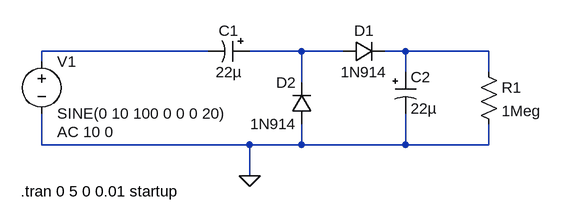
[diagram p0: schematic voltageDoubler.asc]
voltageDoubler.asc, the LTspice schematic file:
Version 4
SHEET 1 880 680
WIRE 224 64 -32 64
WIRE 368 64 288 64
WIRE 432 64 368 64
WIRE 528 64 496 64
WIRE 656 64 528 64
WIRE -32 80 -32 64
WIRE 528 96 528 64
WIRE 656 96 656 64
WIRE 368 112 368 64
WIRE -32 208 -32 160
WIRE 288 208 -32 208
WIRE 368 208 368 176
WIRE 368 208 288 208
WIRE 528 208 528 160
WIRE 528 208 368 208
WIRE 656 208 656 176
WIRE 656 208 528 208
WIRE 288 256 288 208
FLAG 288 256 0
SYMBOL diode 432 80 R270
WINDOW 0 32 32 VTop 2
WINDOW 3 0 32 VBottom 2
SYMATTR InstName D1
SYMATTR Value 1N914
SYMBOL diode 384 176 R180
WINDOW 0 24 64 Left 2
WINDOW 3 24 0 Left 2
SYMATTR InstName D2
SYMATTR Value 1N914
SYMBOL polcap 288 48 R90
WINDOW 0 0 32 VBottom 2
WINDOW 3 32 32 VTop 2
SYMATTR InstName C1
SYMATTR Value 22µ
SYMATTR Description Capacitor
SYMATTR Type cap
SYMATTR SpiceLine V=16 Irms=2.88675 Rser=0.03 Lser=0 mfg="KEMET" pn="A700D226M016ATE030" type="Al electrolytic"
SYMBOL polcap 512 96 R0
SYMATTR InstName C2
SYMATTR Value 22µ
SYMATTR Description Capacitor
SYMATTR Type cap
SYMATTR SpiceLine V=16 Irms=3.72678 Rser=0.018 Lser=0 mfg="KEMET" pn="A700D226M016ATE018" type="Al electrolytic"
SYMBOL voltage -32 64 R0
WINDOW 123 24 124 Left 2
WINDOW 39 0 0 Left 2
SYMATTR Value2 AC 10 0
SYMATTR InstName V1
SYMATTR Value SINE(0 10 100 0 0 0 20)
SYMBOL res 640 80 R0
SYMATTR InstName R1
SYMATTR Value 1Meg
SYMATTR SpiceLine tol=1 pwr=0.1
TEXT -64 280 Left 2 !.tran 0 5 0 0.01 startup

The netlist it stands for:
* voltageDoubler.asc
D1 N002 N003 1N914
D2 0 N002 1N914
C1 N002 N001 22µ V=16 Irms=2.88675 Rser=0.03 Lser=0 mfg="KEMET" pn="A700D226M016ATE030" type="Al electrolytic"
C2 N003 0 22µ V=16 Irms=3.72678 Rser=0.018 Lser=0 mfg="KEMET" pn="A700D226M016ATE018" type="Al electrolytic"
V1 N001 0 SINE(0 10 100 0 0 0 20) AC 10 0
R1 N003 0 1Meg tol=1 pwr=0.1
.model D D
.lib standard.dio
.tran 0 5 0 0.01 startup
.backanno
.end